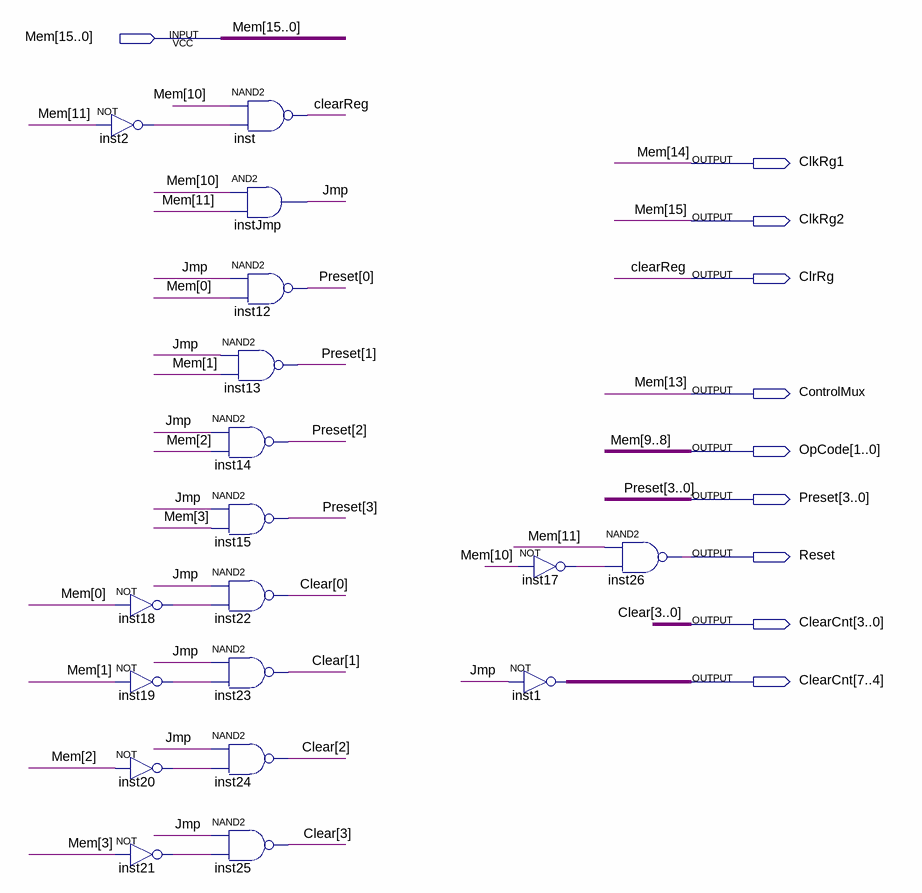
[diagram p0: schematic sheet]
// Quartus schematic UC.bdf as structural Verilog: 18 symbols, 10 pins
module UC (
  input  [15:0] Mem,
  output ClkRg1,
  output ClkRg2,
  output ClrRg,
  output ControlMux,
  output [1:0] OpCode,
  output [3:0] Preset,
  output Reset,
  output [7:0] ClearCnt
);

  wire inst2_out, inst17_out, inst18_out, inst19_out, inst20_out, inst21_out, Jmp;

  not inst2 (inst2_out, Mem[11]);
  not inst18 (inst18_out, Mem[0]);
  not inst19 (inst19_out, Mem[1]);
  not inst20 (inst20_out, Mem[2]);
  not inst21 (inst21_out, Mem[3]);
  nand inst (ClrRg, Mem[10], inst2_out);
  and instJmp (Jmp, Mem[10], Mem[11]);
  nand inst12 (Preset[0], Jmp, Mem[0]);
  nand inst13 (Preset[1], Jmp, Mem[1]);
  nand inst14 (Preset[2], Jmp, Mem[2]);
  nand inst15 (Preset[3], Jmp, Mem[3]);
  nand inst22 (ClearCnt[0], Jmp, inst18_out);
  nand inst23 (ClearCnt[1], Jmp, inst19_out);
  nand inst24 (ClearCnt[2], Jmp, inst20_out);
  nand inst25 (ClearCnt[3], Jmp, inst21_out);
  not inst17 (inst17_out, Mem[10]);
  assign ClearCnt[7:4] = ~{4{Jmp}};  // NOT inst1, 4 bits wide
  nand inst26 (Reset, Mem[11], inst17_out);

  assign ClkRg1 = Mem[14];
  assign ClkRg2 = Mem[15];
  assign ControlMux = Mem[13];
  assign OpCode = Mem[9:8];

  // Other names for the same wires on the sheet: Clear[3:0] = ClearCnt[3:0]; clearReg = ClrRg
endmodule
